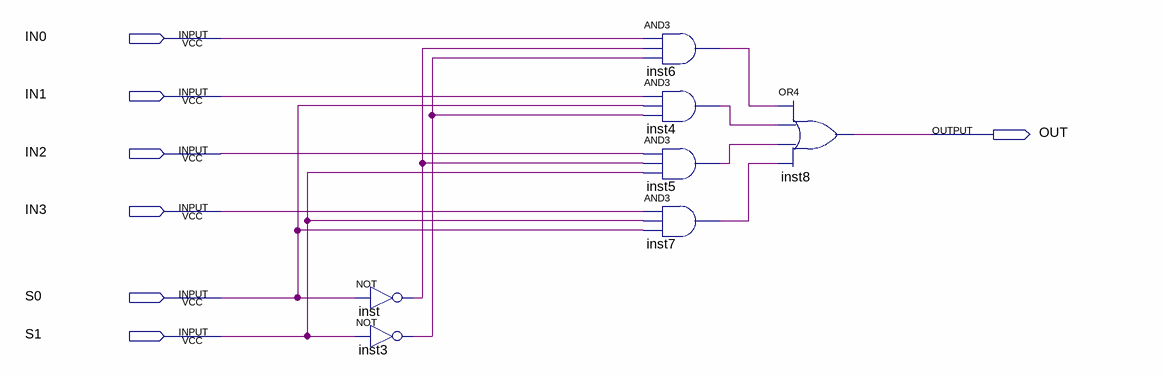
[diagram p0: schematic sheet]
// Quartus schematic 4_1_MUX.bdf as structural Verilog: 7 symbols, 7 pins
module \4_1_MUX  (
  input  IN0,
  input  IN1,
  input  IN2,
  input  IN3,
  input  S0,
  input  S1,
  output OUT
);

  wire inst3_out, inst4_out, inst5_out, inst6_out, inst7_out, inst_out;

  not inst (inst_out, S0);
  not inst3 (inst3_out, S1);
  and inst6 (inst6_out, IN0, inst_out, inst3_out);
  and inst4 (inst4_out, IN1, S0, inst3_out);
  and inst5 (inst5_out, IN2, inst_out, S1);
  and inst7 (inst7_out, IN3, S1, S0);
  or inst8 (OUT, inst6_out, inst4_out, inst5_out, inst7_out);
endmodule
